# EAGLE design TempestShockerUpper (EAGLE 6.6.0)
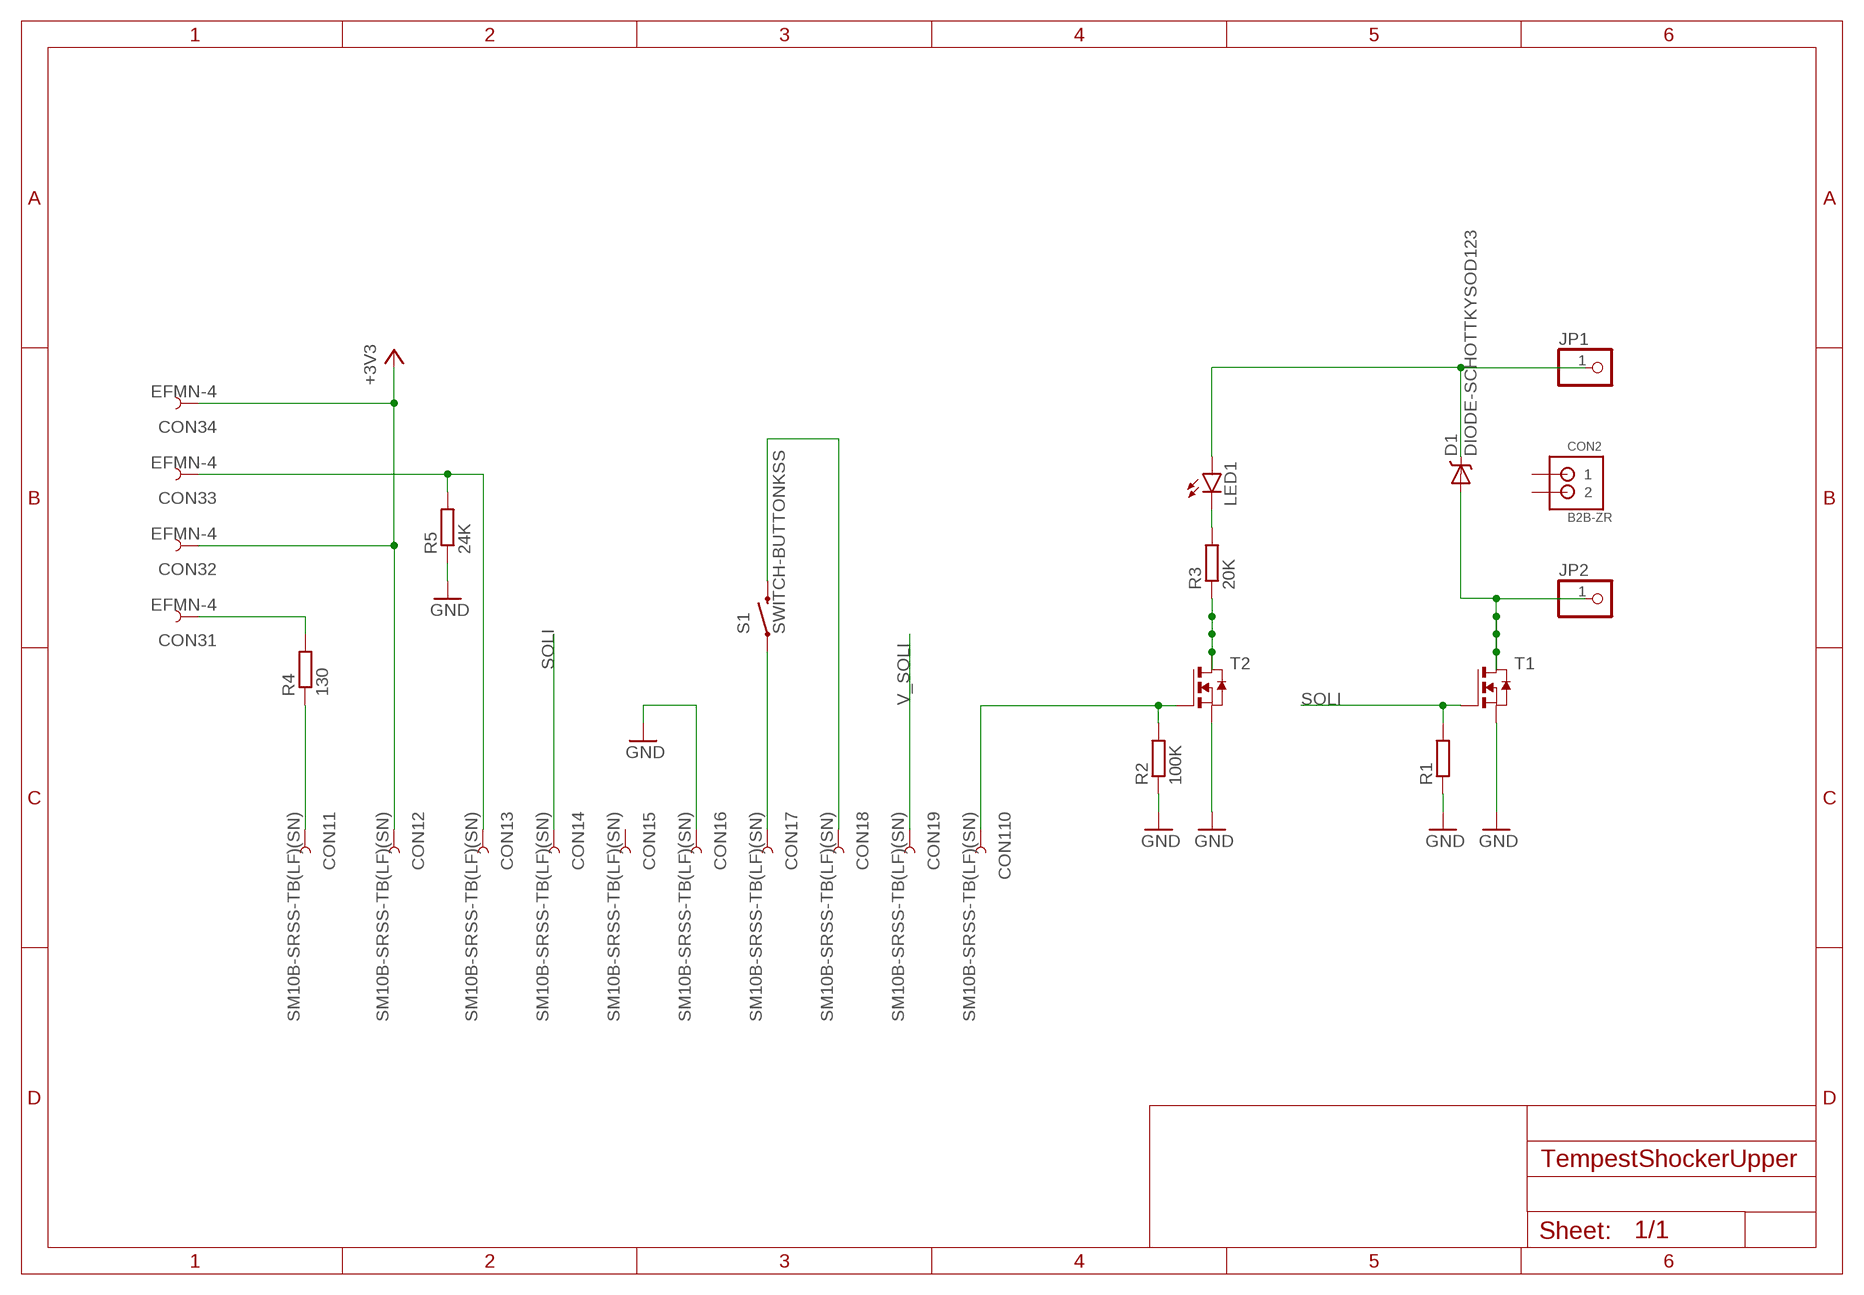
[diagram p0: schematic, sheet 1]

## Parts
CON1  SM10B-SRSS-TB(LF)(SN)  [SM10B-SRSS-TB]
CON2  B2B-ZR  [S2B-ZR]
CON3  EFMN-4  [EFMN-4]
D1  DIODE-SCHOTTKYSOD123  [SOD123]
JP1  PINHD-1X1  [1X01]
JP2  PINHD-1X1  [1X01]
LED1  LED0603  [LED-0603]
R1  R0603  [_0603MP]
R2  100K  R0603  [_0603MP]
R3  20K  R0603  [_0603MP]
R4  130  R0603  [_0603MP]
R5  24K  R0603  [_0603MP]
S1  SWITCH-BUTTONKSS  [KSS]
T1  NMOSSOT23-6  [SOT23-6]
T2  NMOSSOT23-6  [SOT23-6]

## Nets
+3V3: CON1.2 CON3.2 CON3.4
GND: CON1.6 R1.1 R2.1 R5.1 T1.4(S) T2.4(S)
N$1: CON3.1 R4.2
N$2: CON1.1 R4.1
N$3: CON1.3 CON3.3 R5.2
N$4: CON1.10 R2.2 T2.3(G)
N$5: CON1.7 S1.1
N$6: CON1.8 S1.2
N$7: LED1.C R3.2
N$8: R3.1 T2.1(D) T2.2(D1) T2.5(D2) T2.6(D3)
N$10: D1.A JP2.1 T1.1(D) T1.2(D1) T1.5(D2) T1.6(D3)
SOLI: CON1.4 R1.2 T1.3(G)
V_SOLI: CON1.9 D1.C JP1.1 LED1.A
Unconnected: CON1.5 CON2.1 CON2.2

## Library data of the parts
CON1 = squirrel:SM10B-SRSS-TB(LF)(SN)
CON2 = squirrel:B2B-ZR
CON3 = squirrel:EFMN-4
D1 = squirrel:DIODE-SCHOTTKY: Commonly MBRA140.
JP1 JP2 = pinhead:PINHD-1X1: PIN HEADER
LED1 = SparkFun-LED:LED: LEDs Standard schematic elements and footprints for 5mm, 3mm, 1206, and 0603 sized LEDs. 5mm - Spark Fun Electronics SKU : COM-00529 (and others)
R1-R5 = squirrel:R
S1 = squirrel:SWITCH-BUTTON: Various NO switches- pushbuttons, reed, etc
T1 T2 = squirrel:NMOSSOT23-6: MOS FET

## Board
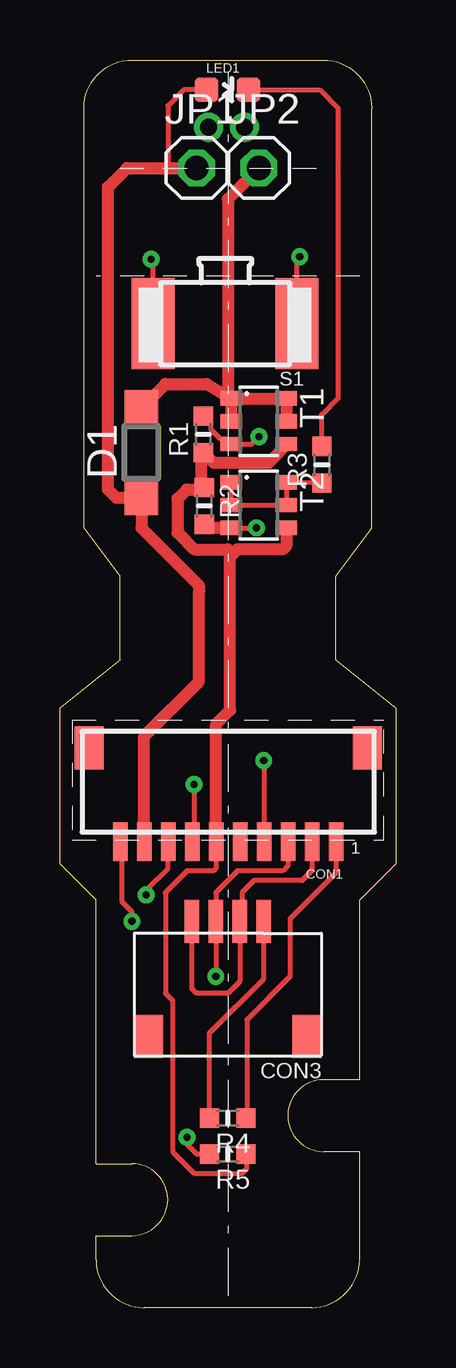
[diagram p1: board, top side]
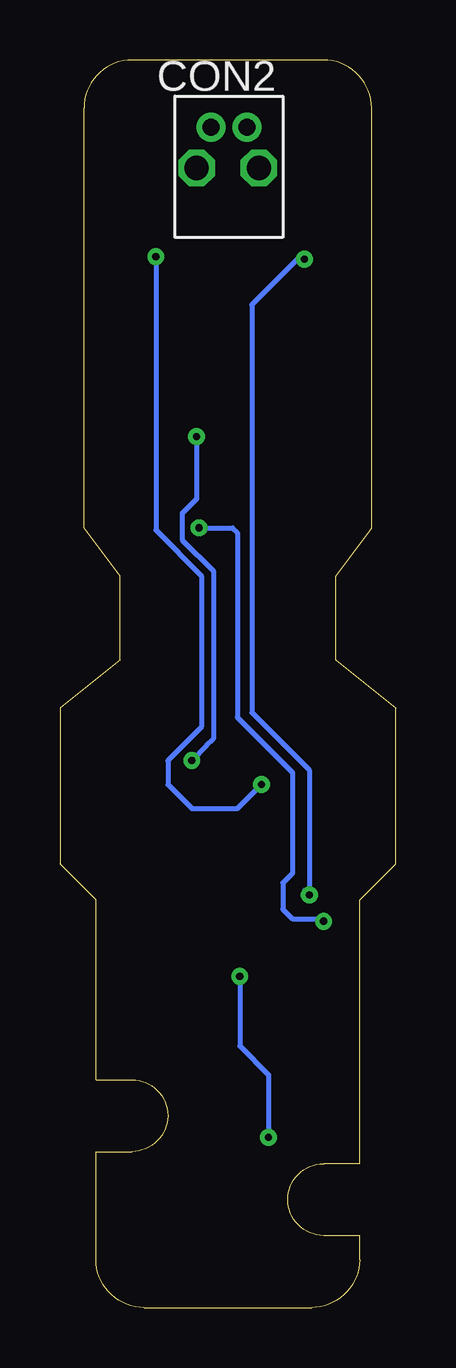
[diagram p2: board, bottom side, seen from below]

Size 14 x 52 mm. Coordinates in mm from the lower left corner, seen from the top.
Copper layers (1*16): Top 0.035mm / dielectric 1.5mm / Bottom 0.035mm
Design rules "default": minimum track width 10mil, minimum drill 24mil, track to track 8mil, track to pad 8mil, pad to pad 8mil, via to via 8mil, smd to smd 8mil, copper to edge 40mil, drill to drill 8mil, minimum pad ring 10mil, minimum via ring 8mil, stop-mask expansion 4mil, vias tented up to drill 0mil, thermal gap 10mil

### Footprints (pad centres in the part's own frame; a part is rotated, then mirrored left to right if it is on the bottom)
SM10B-SRSS-TB = smd 0.6 x 1.6: 1 -4.5,0; 2 -3.5,0; 3 -2.5,0; 4 -1.5,0; 5 -0.5,0; 6 0.5,0; 7 1.5,0; 8 2.5,0; 9 3.5,0; 10 4.5,0 | smd 1.2 x 1.8: MNT1 5.8,-3.9; MNT2 -5.8,-3.9
S2B-ZR = drill 0.7 pad 1.1: 1 0,-1.3; 2 1.5,-1.3
EFMN-4 = smd 0.6 x 1.8: 1 0,0; 2 1,0; 3 2,0; 4 3,0 | smd 1.2 x 1.8: P$5 -1.8,4.8; P$6 4.8,4.8
SOD123 = smd 1.4 x 1.4: A 1.9,0; C -1.9,0
1X01 = drill 1.016 octagon: 1 0,0
LED-0603 = smd 1 x 1: A 0,-0.877; C 0,0.877
_0603MP = smd 0.8 x 0.8: 1 -0.762,0; 2 0.762,0
KSS = smd 1.8 x 3.8: 1 0.9,1.9; 2 6.9,1.9
SOT23-6 = smd 0.6 x 0.9: 1 -0.95,-1.15; 2 0,-1.15; 3 0.95,-1.15; 4 0.95,1.15; 5 0,1.15; 6 -0.95,1.15

### Placement (x,y rotation side)
CON1  7.02,19.42 180 top
CON2  7.7,50.5 0 bottom
CON3  8.5,16.1 180 top
D1  3.39,35.64 90 top
JP1  5.7,47.5 0 top
JP2  8.3,47.5 0 top
LED1  6.99,50.76 270 top
R1  5.98,36.4 90 top
R2  6.02,33.41 270 top
R3  10.93,35.13 90 top
R4  7,7.9 180 top
R5  7,6.4 180 top
S1  10.79,42.91 180 top
T1  8.29,36.94 270 top
T2  8.29,33.45 270 top
U$1  [SHOCKER-OUTLINE-UPPER]  0,0 0 top

### Tracks (layer width: path | path; a pad name or v marks a point on that pad's centre or on a via)
+3V3
  Top 0.2: CON1.2 10.52,18.22 10.1,17.8 8.1,17.8 7.6,17.3 7.6,16.2 CON3.2 7.5,13.6 7,13.1 5.7,13.1 5.5,13.3 CON3.4
GND
  Top 0.2: CON1.6 6.52,18.32 6.4,18.2 5.3,18.2 4.4,17.3 4.4,13.1 4.7,12.8 4.7,6.5 5.6,5.6 7.6,5.6 7.8,5.8 7.8,6.36 R5.1 | R1.1 5.88,35.42
  Top 0.5: T1.4 9.04,35.54 8.7,35.2 6.8,35.2 6.42,35.2 R1.1 5.9,35.56 5.9,34.2 5.95,34.25 6.1,34.25 R2.1 5.95,34.1 5.3,34.1 4.9,33.7 4.9,32.3 5.6,31.6 7,31.6 7.2,31.4 | CON1.6 6.52,24.32 7.1,24.9 7.1,31.3 7.2,31.4 | T2.4 9.44,31.74 9.3,31.6 7.4,31.6 7.2,31.4
N$1
  Top 0.2: R4.2 6.24,11.44 8.5,13.7 CON3.1
N$2
  Top 0.2: CON1.1 11.52,18.12 10.6,17.2 9.6,16.2 9.6,13.8 7.8,12 7.8,7.94 R4.1
N$3  (via drill 0.3)
  Top 0.2: CON1.3 9.52,18.42 9.3,18.2 7.4,18.2 6.5,17.3 CON3.3 v6.5,13.8 | v5.3,7.1 5.3,6.8 5.7,6.4 R5.2
  Bottom 0.2: v6.5,13.8 6.5,10.9 5.3,9.7 v5.3,7.1
N$4  (via drill 0.3)
  Top 0.2: 6.17,32.5 v8.2,32.5 | v3,16.1 3,16.5 2.6,16.9 2.6,19.34 CON1.10
  Top 0.5: T2.3 6.17,32.5 R2.2
  Bottom 0.2: v8.2,32.5 6.8,32.5 6.6,32.3 6.6,24.6 4.3,22.3 4.3,18.1 4.7,17.7 4.7,16.6 4.3,16.2 3.1,16.2 v3,16.1
N$5  (via drill 0.3)
  Top 0.2: S1.1 9.89,43.69 v10,43.8 | v5.6,21.8 5.6,19.5 CON1.7
  Bottom 0.2: v10,43.8 10,32.4 8.1,30.5 8.1,24.2 9.5,22.8 9.5,21.8 8.5,20.8 6.6,20.8 v5.6,21.8
N$6  (via drill 0.3)
  Top 0.2: S1.2 3.89,43.61 v3.8,43.7 | v3.6,17.2 3.6,17.4 4.5,18.3 4.5,19.4 CON1.8
  Bottom 0.2: 3.8,17.4 v3.6,17.2 3.6,22.4 6,24.8 6,41.8 4.1,43.7 v3.8,43.7
N$7
  Top 0.2: LED1.C 10.84,50.76 11.6,50 11.6,37.9 10.9,37.2 10.9,35.92 R3.2
N$8
  Top 0.2: R3.1 10.1,34.4 T2.6 T2.5 T2.2 T2.1
N$10
  Top 0.5: D1.A 3.44,37.54 4.4,38.5 6.13,38.5 T1.1 | T1.1 T1.2 | T1.1 T1.6 T1.5 | JP2.1 7,46.2 7,38.15 T1.1
SOLI  (via drill 0.3)
  Top 0.2: R1.2 6.3,36.74 6.3,36.6 6.7,36.2 6.93,36.2 T1.3 7.99,35.99 v8.3,36.3 | v8.5,22.8 8.5,19.44 CON1.4
  Bottom 0.2: v8.3,36.3 8.3,33.7 8.9,33.1 8.9,32 7.6,30.7 7.6,23.7 7.9,23.4 v8.5,22.8
V_SOLI
  Top 0.2: LED1.A 5.16,50.76 4.5,50.1 4.5,47.7 4.7,47.5
  Top 0.406: D1.C
  Top 0.5: CON1.9 3.52,23.82 5.8,26.1 5.8,29.8 5.8,30.1 5.6,30.3 3.4,32.5 D1.C | D1.C 2.36,33.74 2,34.1 2,46.7 2.8,47.5 4.7,47.5 JP1.1